# EAGLE design Electronic Cricket (EAGLE 9.6.2)
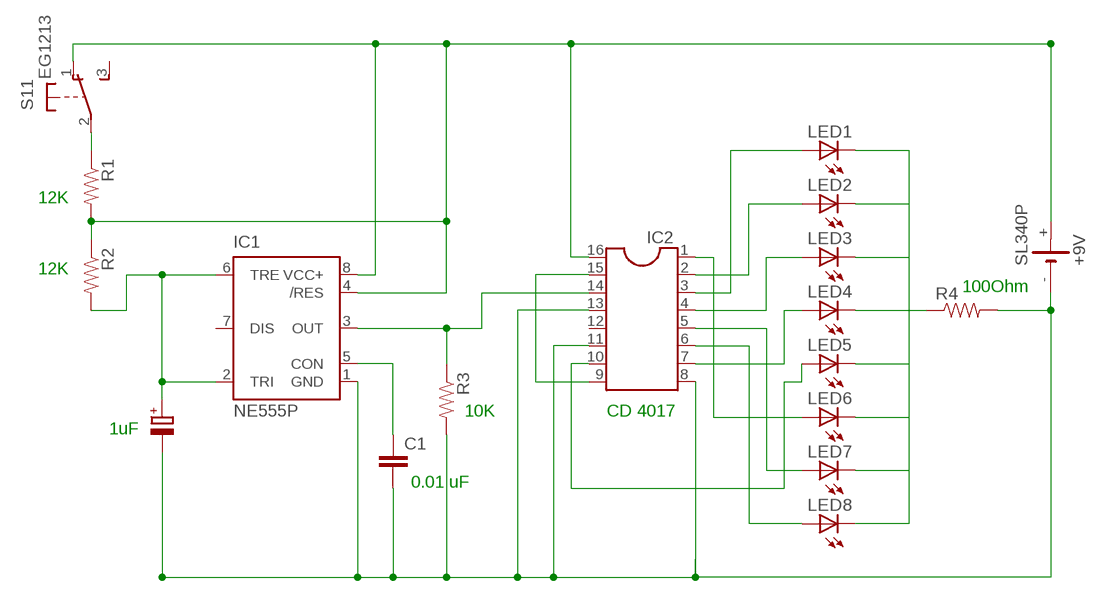
[diagram p0: schematic, sheet 1]

## Parts
+9V  SL340P  [SL-340/P3.6V]
C1  C2.5/6  [C2.5-6]
IC1  NE555P  [DIL-08]
IC2  DIL16  [DIL16]
LED1  LEDB156  [Q62902-B156]
LED2  LEDB156  [Q62902-B156]
LED3  LEDB156  [Q62902-B156]
LED4  LEDB156  [Q62902-B156]
LED5  LEDB156  [Q62902-B156]
LED6  LEDB156  [Q62902-B156]
LED7  LEDB156  [Q62902-B156]
LED8  LEDB156  [Q62902-B156]
R1  RESISTORAXIAL-0.3  [AXIAL-0.3]
R2  RESISTORAXIAL-0.3  [AXIAL-0.3]
R3  RESISTORAXIAL-0.3  [AXIAL-0.3]
R4  RESISTORAXIAL-0.3  [AXIAL-0.3]
S1  EG1213  [EG1213]

## Nets
N$1: IC2.3 LED1.A
N$2: IC2.2 LED2.A
N$3: IC2.4 LED3.A
N$4: IC2.7 LED4.A
N$5: IC2.10 LED5.A
N$6: IC2.1 LED6.A
N$7: IC2.5 LED7.A
N$8: IC2.9 IC2.15
N$9: +9V.- C1.2 IC1.1(GND) IC2.8 IC2.11 IC2.13 R3.P$2 R4.P$2
N$10: IC2.6 LED8.A
N$11: R1.P$1 S1.2(1:P)
N$13: LED1.K(C) LED2.K(C) LED3.K(C) LED4.K(C) LED5.K(C) LED6.K(C) LED7.K(C) LED8.K(C) R4.P$1
N$14: IC1.3(OUT) IC2.14 R3.P$1
N$18: +9V.+ IC1.4(/RES) IC1.8(VCC+) IC2.16 R1.P$2 R2.P$1 S1.1(1:O)
N$19: IC1.2(TRI) IC1.6(TRE) R2.P$2
N$21: C1.1 IC1.5(CON)
Unconnected: IC1.7(DIS) IC2.12 S1.3(1:S) S1.MT1(MT) S1.MT2(MT)

## Notes on the sheet
- 12K
- 12K
- 100Ohm
- 10K | CD 4017
- 1uF
- 0.01 uF

## Library data of the parts
+9V = battery:SL340P: LI BATTERY Sonnenschein SL-340 P 3.6 V
C1 = capacitor-wima:C: CAPACITOR naming: grid - package width
IC1 = SparkFun-AnalogIC:NE555: General purpose bipolar Timer; MF: Arrow Electronics; MPN: NE555N; OC_FARNELL: 1467742; OC_NEWARK: 89K1486
IC2 = ic-package:DIL16: Dual In Line / Socket
LED1-LED8 = led:LED: LED OSRAM: - CHIPLED LG R971, LG N971, LY N971, LG Q971, LY Q971, LO R971, LY R971 LH N974, LH R974 LS Q976, LO Q976, LY Q976 LO Q996 - Hyper CHIPLED LW Q18S LB Q993, LB Q99A, LB R99A - SideLED LS A670, LO A670, LY A670, LG A670, LP A670 LB A673, LV A673, LT A673, LW A673 LH A674 LY A675 LS A676, LA A676, LO A676, LY A676, LW A676 LS A679, LY A679, LG A679 - Hyper Micro SIDELED® LS Y876, LA Y876, LO Y876, LY Y876 LT Y87S - SmartLED LW L88C, LW L88S LB L89C, LB L89S, LG L890 LS L89K, LO L89K, LY L89K LS L896, LA L896, LO L896, LY L896 - TOPLED LS T670, LO T670, LY T670, LG T670, LP T670 LSG T670, LSP T670, LSY T670, LOP T670, LYG T670 LG T671, LOG T671, LSG T671 LB T673, LV T673, LT T673, LW T673 LH T674 LS T676, LA T676, LO T676, LY T676, LB T676, LH T676, LSB T676, LW T676 LB T67C, LV T67C, LT T67C, LS T67K, LO T67K, LY T67K, LW E67C LS E67B, LA E67B, LO E67B, LY E67B, LB E67C, LV E67C, LT E67C LW T67C LS T679, LY T679, LG T679 LS T770, LO T770, LY T770, LG T770, LP T770 LB T773, LV T773, LT T773, LW T773 LH T774 LS E675, LA E675, LY E675, LS T675 LS T776, LA T776, LO T776, LY T776, LB T776 LHGB T686 LT T68C, LB T68C - Hyper Mini TOPLED® LB M676 - Mini TOPLED Santana® LG M470 LS M47K, LO M47K, LY M47K Source: http://www.osram.convergy.de LUXEON: - LUMILED® LXK2-PW12-R00, LXK2-PW12-S00, LXK2-PW14-U00, LXK2-PW14-V00 LXK2-PM12-R00, LXK2-PM12-S00, LXK2-PM14-U00 LXK2-PE12-Q00, LXK2-PE12-R00, LXK2-PE12-S00, LXK2-PE14-T00, LXK2-PE14-U00 LXK2-PB12-K00, LXK2-PB12-L00, LXK2-PB12-M00, LXK2-PB14-N00, LXK2-PB14-P00, LXK2-PB14-Q00 LXK2-PR12-L00, LXK2-PR12-M00, LXK2-PR14-Q00, LXK2-PR14-R00 LXK2-PD12-Q00, LXK2-PD12-R00, LXK2-PD12-S00 LXK2-PH12-R00, LXK2-PH12-S00 LXK2-PL12-P00, LXK2-PL12-Q00, LXK2-PL12-R00 Source: www.luxeon.com KINGBRIGHT: KA-3528ASYC Source: www.kingbright.com
R1-R4 = SparkFun-Passives:RESISTOR: Resistor Basic schematic elements and footprints for 0603, 1206, and PTH resistors.
S1 = adafruit:EG1213: E-Switch right-angle slide SPDT Part #EG1213 http://www.ladyada.net/library/eagle

## Board
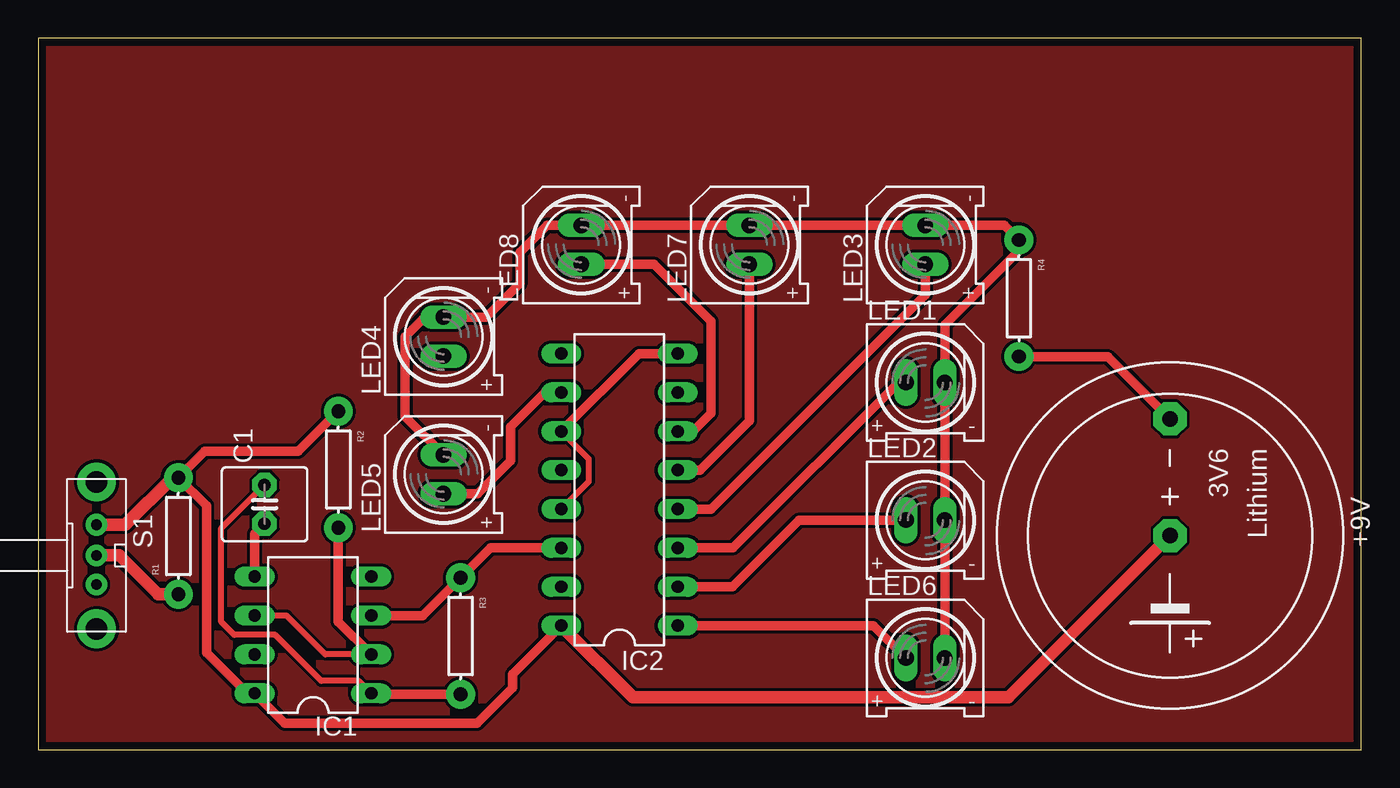
[diagram p1: board, top side]
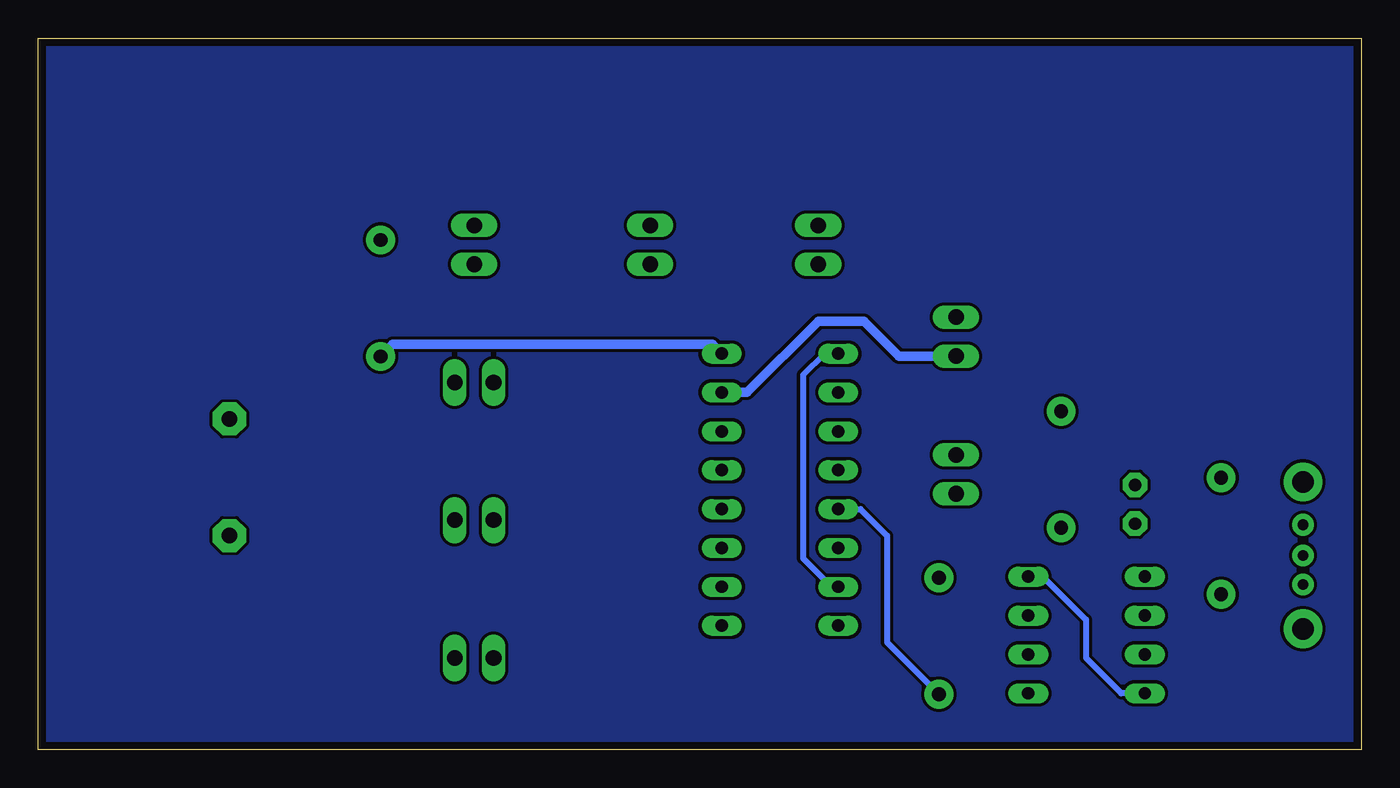
[diagram p2: board, bottom side, seen from below]

Size 86.5 x 46.5 mm. Coordinates in mm from the lower left corner, seen from the top.
Outline: 0,0 86.5,0 86.5,46.5 0,46.5 0,0
Copper layers (1*16): Top 0.035mm / dielectric 1.5mm / Bottom 0.035mm
Design rules "default *": minimum track width 6mil, minimum drill 0.35mm, track to track 0.2mm, track to pad 0.2mm, pad to pad 0.5mm, via to via 6mil, smd to smd 6mil, copper to edge 0.5mm, drill to drill 6mil, minimum pad ring 10mil, minimum via ring 8mil, stop-mask expansion 4mil, vias tented up to drill 0mil, thermal gap 10mil

### Footprints (pad centres in the part's own frame; a part is rotated, then mirrored left to right if it is on the bottom)
SL-340/P3.6V = drill 1.016 pad 2.159 octagon: + 0,0; - -7.62,0
C2.5-6 = drill 0.813 pad 1.6 octagon: 1 -1.27,0; 2 1.27,0
DIL-08 = drill 0.813 long: 1 -3.81,-3.81; 2 -1.27,-3.81; 3 1.27,-3.81; 4 3.81,-3.81; 5 3.81,3.81; 6 1.27,3.81; 7 -1.27,3.81; 8 -3.81,3.81
DIL16 = drill 0.813 long: 1 -8.89,-3.81; 2 -6.35,-3.81; 3 -3.81,-3.81; 4 -1.27,-3.81; 5 1.27,-3.81; 6 3.81,-3.81; 7 6.35,-3.81; 8 8.89,-3.81; 9 8.89,3.81; 10 6.35,3.81; 11 3.81,3.81; 12 1.27,3.81; 13 -1.27,3.81; 14 -3.81,3.81; 15 -6.35,3.81; 16 -8.89,3.81
Q62902-B156 = drill 1.016 long: A -1.27,0; K 1.27,0
AXIAL-0.3 = drill 0.9 pad 1.88: P$1 -3.81,0; P$2 3.81,0
EG1213 = drill 0.7 pad 1.422: 1 -2,0; 2 0,0; 3 1.9,0 | drill 1.4 pad 2.54: MT1 -4.8,0; MT2 4.8,0

### Placement (x,y rotation side)
+9V  74,14 270 top
C1  14.8,16.04 90 top
IC1  17.96,7.5 90 top
IC2  38,17 90 top
LED1  58,24 0 top
LED2  58,15 0 top
LED3  58,33 90 top
LED4  26.5,27 90 top
LED5  26.5,18 90 top
LED6  58,6 0 top
LED7  46.5,33 90 top
LED8  35.5,33 90 top
R1  9.16,13.97 90 top
R2  19.62,18.31 270 top
R3  27.61,7.43 270 top
R4  64.12,29.51 270 top
S1  3.81,12.7 270 top

### Tracks (layer width: path | path; a pad name or v marks a point on that pad's centre or on a via)
GND
  pour Top: 0,0 0,46.5 86.5,46.5 86.5,0
  pour Bottom: 0,0 0,46.5 86.5,46.5 86.5,0
N$1
  Top 0.61: IC2.3 45.42,13.19 56.23,24 LED1.A
N$2
  Top 0.61: LED2.A 49.73,15 45.38,10.65 IC2.2
N$3
  Top 0.61: IC2.4 44,15.73 58,29.73 LED3.A
N$4
  Bottom 0.61: IC2.7 40.15,23.35 35.5,28 32.5,28 30.23,25.73 LED4.A
N$5
  Top 0.61: IC2.10 33.12,23.35 30.89,21.11 30.89,18.89 28.73,16.73 LED5.A
N$6
  Top 0.61: LED6.A 54.62,8.11 IC2.1
N$7
  Top 0.61: IC2.5 43.27,18.27 46.5,21.5 LED7.A
N$8
  Bottom 0.406: IC2.9 35.11,25.89 36.5,24.5 36.5,12.5 34.65,10.65 IC2.15
N$9
  Top 0.406: IC1.1 20.96,4.5 18.5,4.5 15.5,7.5 12.82,7.5 11.97,8.35 11.97,14.48 C1.2 | IC2.13 36,17.54 36,19 IC2.11
  Top 0.61: IC2.11 39.27,25.89 IC2.8 | +9V.- 69.92,25.7 R4.P$2 | R3.P$2 21.84,3.62 IC1.1
  Bottom 0.406: IC2.13 32.73,15.73 31,14 31,7.01 R3.P$2
  Bottom 0.61: IC2.8 42.42,26.5 63.32,26.5 R4.P$2
N$10
  Top 0.61: IC2.6 42.81,20.81 44,22 44,28 40.27,31.73 LED8.A
N$11
  Top 0.813: R1.P$1 7.84,10.16 5.3,12.7 S1.2
N$13
  Top 0.61: LED6.K LED2.K LED1.K 59.27,27.77 64.12,32.62 R4.P$1 63.17,34.27 LED3.K LED7.K LED8.K 33.27,34.27 31.5,32.5 31.5,30.5 29.27,28.27 LED4.K 25.27,28.27 24,27 24,21.77 LED5.K
N$14
  Top 0.61: IC1.3 25.14,8.77 R3.P$1 29.56,13.19 IC2.14
N$18
  Top 0.61: IC2.16 31,4.92 31,4.03 28.69,1.72 16.12,1.72 IC1.8 13.65,3.69 11,6.34 11,15.94 R1.P$2 10.88,19.5 17,19.5 R2.P$1
  Top 0.813: S1.1 5.7,14.7 8.78,17.78 R1.P$2 | +9V.+ 63.42,3.42 38.88,3.42 IC2.16
  Bottom 0.406: IC1.8 15.69,3.69 18,6 18,8.5 20.81,11.31 IC1.4
N$19
  Top 0.406: IC1.2 18.77,6.23 16.23,8.77 IC1.6
  Top 0.61: IC1.2 19.62,8.38 R2.P$2
N$21
  Top 0.61: IC1.5 14.15,14.12 C1.1